# Altium schematic sheet [03] - MCU.SchDoc
size A3
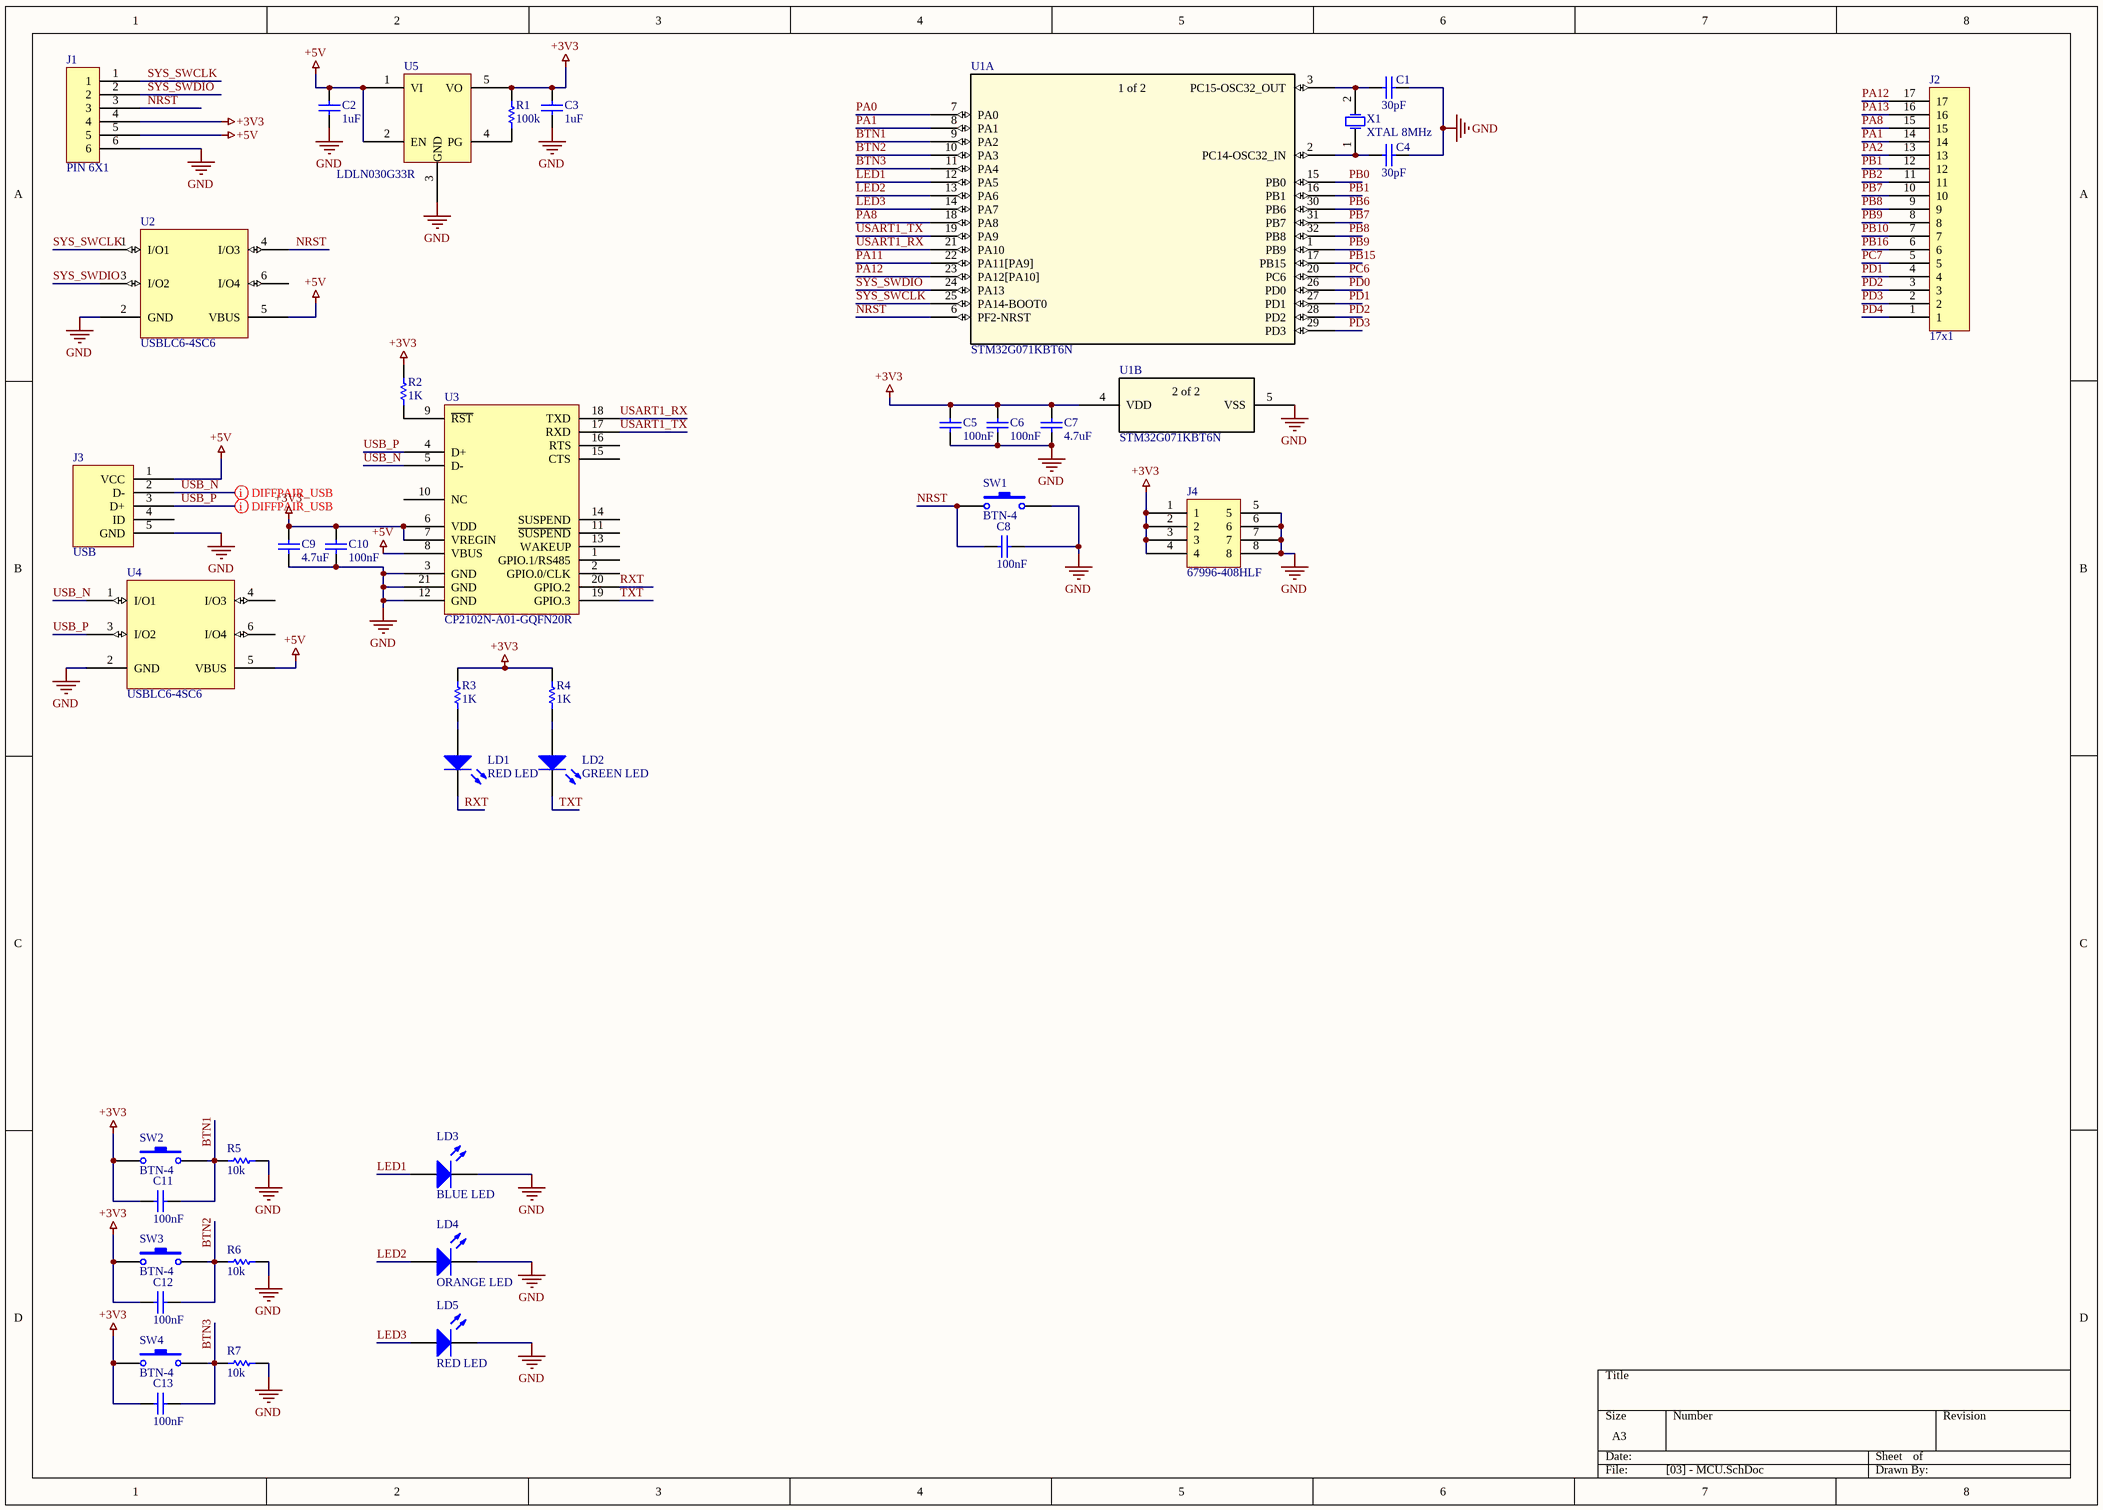
[diagram p0: [03] - MCU.SchDoc]

## Parts
C1  30pF  [CAPC2012X08N]
C2  1uF
C3  1uF
C4  30pF  [CAPC2012X08N]
C5  100nF  [CAPC2012X08N]
C6  100nF  [CAPC2012X08N]
C7  4.7uF
C8  100nF  [CAPC2012X08N]
C9  4.7uF
C10  100nF  [CAPC2012X08N]
C11  100nF  [CAPC2012X08N]
C12  100nF  [CAPC2012X08N]
C13  100nF  [CAPC2012X08N]
J1  PIN 6X1  [PIN6X1]
J2  17x1  [PIN17X1]
J3  USB  [AMPHENOL-usb]
J4  67996-408HLF  [PIN8X2]
LD1  RED LED  [LED SML]
LD2  GREEN LED  [LED SML]
LD3  BLUE LED  [LED APHD]
LD4  ORANGE LED  [LED SML]
LD5  RED LED  [LED SML]
R1  100k
R2  1K
R3  1K
R4  1K
R5  10k
R6  10k
R7  10k
SW1  BTN-4  [PTS645]
SW2  BTN-4  [PTS645]
SW3  BTN-4  [PTS645]
SW4  BTN-4  [PTS645]
U1  STM32G071KBT6N  [LQFP-32]  (parts A,B of 2)
U2  USBLC6-4SC6  [SOT95P280X145-6N]
U3  CP2102N-A01-GQFN20R  [*SILABS_QFN20]
U4  USBLC6-4SC6  [SOT95P280X145-6N]
U5  LDLN030G33R  [SOT95P280X100-5N]
X1  XTAL 8MHz  [HC-49S]

## Nets
+3V3: C3.2 C5.2 C6.2 C7.2 C9.2 C10.2 C11.2 C12.2 C13.2 J1.4 J4.1 J4.2 J4.3 J4.4 R1.2 R2.2 R3.1 R4.1 SW2.1 SW3.1 SW4.1 U1.4(VDD) U3.6(VDD) U3.7(VREGIN) U5.5(VO)
+5V: C2.2 J1.5 J3.1(VCC) U2.5(VBUS) U3.8(VBUS) U4.5(VBUS) U5.1(VI) U5.2(EN)
GND: C1.2 C2.1 C3.1 C4.2 C5.1 C6.1 C7.1 C8.1 C9.1 C10.1 J1.6 J3.5(GND) J4.5 J4.6 J4.7 J4.8 LD3.2(K) LD4.2(K) LD5.2(K) R5.2 R6.2 R7.2 SW1.2 U1.5(VSS) U2.2(GND) U3.3(GND) U3.12(GND) U3.21(GND) U4.2(GND) U5.3(GND)
BTN1: C11.1 R5.1 SW2.2 U1.9(PA2)
BTN2: C12.1 R6.1 SW3.2 U1.10(PA3)
BTN3: C13.1 R7.1 SW4.2 U1.11(PA4)
LED1: LD3.1(A) U1.12(PA5)
LED2: LD4.1(A) U1.13(PA6)
LED3: LD5.1(A) U1.14(PA7)
NRST: C8.2 J1.3 SW1.1 U1.6(PF2-NRST) U2.4(I/O3)
PA0: U1.7(PA0)
PA1: J2.14 U1.8(PA1)
PA2: J2.13
PA8: J2.15 U1.18(PA8)
PA11: U1.22(PA11[PA9])
PA12: J2.17 U1.23(PA12[PA10])
PA13: J2.16
PB0: U1.15(PB0)
PB1: J2.12 U1.16(PB1)
PB2: J2.11
PB6: U1.30(PB6)
PB7: J2.10 U1.31(PB7)
PB8: J2.9 U1.32(PB8)
PB9: J2.8 U1.1(PB9)
PB10: J2.7
PB15: U1.17(PB15)
PB16: J2.6
PC6: U1.20(PC6)
PC7: J2.5
PD0: U1.26(PD0)
PD1: J2.4 U1.27(PD1)
PD2: J2.3 U1.28(PD2)
PD3: J2.2 U1.29(PD3)
PD4: J2.1
RXT: LD1.2(K) U3.20(GPIO.2)
SYS_SWCLK: J1.1 U1.25(PA14-BOOT0) U2.1(I/O1)
SYS_SWDIO: J1.2 U1.24(PA13) U2.3(I/O2)
TXT: LD2.2(K) U3.19(GPIO.3)
USART1_RX: U1.21(PA10) U3.18(TXD)
USART1_TX: U1.19(PA9) U3.17(RXD)
USB_N: J3.2(D-) U3.5(D-) U4.1(I/O1)
USB_P: J3.3(D+) U3.4(D+) U4.3(I/O2)
NetC1_1: C1.1 U1.3(PC15-OSC32_OUT) X1.2(OSC2)
NetC4_1: C4.1 U1.2(PC14-OSC32_IN) X1.1(OSC1)
NetLD1_1: LD1.1(A) R3.2
NetLD2_1: LD2.1(A) R4.2
NetR1_1: R1.1 U5.4(PG)
NetR2_1: R2.1 U3.9(~{RST})

Not connected (* = marked no-connect by the designer): J3 4(ID); U2 6(I/O4); U3 1(GPIO.1/RS485) 2(GPIO.0/CLK) 10(NC) 11(~{SUSPEND}) 13(WAKEUP) 14(SUSPEND) 15(CTS) 16(RTS); U4 4(I/O3) 6(I/O4)

## Layout directives
differential pair: USB_N, USB_P

## Notes on the sheet
- (in symbol STM32G071KBT6N, part A) 1 of 2
- (in symbol STM32G071KBT6N, part B) 2 of 2

## Library data of the parts
C1 C4 = CL21C300JBANNNC: Cap Ceramic 30pF 50V C0G 5% SMD 0805 125C Paper T/R; Manufacturer: Samsung; Temperature Coefficient: 300ppm/°C; Supplier 1: Digi-Key; Manufacturer Part Number: CL21C300JBANNNC; Stock 1: 1482; Pricing 1: 1 = 0,10000, 10 = 0,06500, 100 = 0,02910, 500 = 0,02080, 1000 = 0,01634 (USD); RoHS: Yes; Mount: Surface Mount; Case/Package: 0805; Case Code (Metric): 2012; Case Code (Imperial): 0805; Min Operating Temperature: -55°C; Max Operating Temperature: 125°C; Package Quantity: 1; Packaging: Tape and Reel; Capacitance: 30pF; Tolerance: 5%; Voltage Rating: 50V; Dielectric: C0G; Voltage: 50V; Length: 2mm; Height: 0.65mm; Width: 0.049inch; Thickness: 0.03inch; Depth: 1.25mm; Radiation Hardening: No; ComponentLink1URL: https://datasheet.ciiva.com/26878/getdatasheetpartid-664450-26878150.pdf?src-supplier=Verical; ComponentLink1Description: https://datasheet.ciiva.com/26878/getdatasheetpartid-664450-26878150.pdf?src-supplier=Verical; ComponentLink2URL: https://datasheet.ciiva.com/16428/cl21c020bbannnc-16428903.pdf?src-supplier=Future+Electronics; ComponentLink2Description: https://datasheet.ciiva.com/16428/cl21c020bbannnc-16428903.pdf?src-supplier=Future+Electronics; Supplier Part Number 1: 1276-1130-1-ND
C2 C3 = CL21B105KAFNNNE: Cap Ceramic 1uF 25V X7R 10% SMD 0805 125C T/R; Manufacturer: Samsung; Supplier 1: Digi-Key; Manufacturer Part Number: CL21B105KAFNNNE; Stock 1: 1389367; Pricing 1: 1 = 0,11000, 10 = 0,07900, 100 = 0,03520, 500 = 0,02516, 1000 = 0,01977 (USD); RoHS: Yes; Mount: Surface Mount; Case/Package: 0805; Contact Plating: Tin; Case Code (Metric): 2012; Case Code (Imperial): 0805; Min Operating Temperature: -55°C; Max Operating Temperature: 125°C; Packaging: Tape and Reel; Package Quantity: 1; Capacitance: 1uF; Tolerance: 10%; Voltage Rating: 25V; Dielectric: X7R; Voltage: 25V; Voltage Rating (DC): 25V; Length: 2mm; Height: 1.25mm; Depth: 1.25mm; Width: 0.049inch; Thickness: 0.053inch; Radiation Hardening: No; Lead Free: Lead Free; ComponentLink1URL: https://datasheet.ciiva.com/25800/cl21b105kafnnne-25800163.pdf?src-supplier=Digi-Key; ComponentLink1Description: https://datasheet.ciiva.com/25800/cl21b105kafnnne-25800163.pdf?src-supplier=Digi-Key; ComponentLink2URL: https://datasheet.ciiva.com/15195/getdatasheetpartid-355205-15195880.pdf?src-supplier=Verical; ComponentLink2Description: https://datasheet.ciiva.com/15195/getdatasheetpartid-355205-15195880.pdf?src-supplier=Verical; Supplier Part Number 1: 1276-1066-1-ND
C5 C6 C8 C10-C13 = CL21F104ZBCNNNC: Cap Ceramic 0.1uF 50V Y5V -20% to 80% SMD 0805 85C Paper T/R; Manufacturer: Samsung; Supplier 1: Digi-Key; Manufacturer Part Number: CL21F104ZBCNNNC; Stock 1: 3380807; Pricing 1: 1 = 0,10000, 10 = 0,04400, 100 = 0,01950, 500 = 0,01390, 1000 = 0,01092 (USD); RoHS: Yes; Mount: Surface Mount; Case/Package: 0805; Case Code (Metric): 2012; Case Code (Imperial): 0805; Material: Ceramic; Min Operating Temperature: -30°C; Max Operating Temperature: 85°C; Capacitance: 100nF; Tolerance: 80%; Dielectric: Y5V; Packaging: Tape and Reel; Voltage Rating: 50V; Package Quantity: 1; Length: 2mm; Height: 0.85mm; Width: 0.049inch; Thickness: 0.037inch; Depth: 1.25mm; Radiation Hardening: No; ComponentLink1URL: https://datasheet.ciiva.com/26878/getdatasheetpartid-466953-26878177.pdf?src-supplier=Verical; ComponentLink1Description: https://datasheet.ciiva.com/26878/getdatasheetpartid-466953-26878177.pdf?src-supplier=Verical; ComponentLink2URL: https://datasheet.ciiva.com/29199/454191-da-01-en-vs-kondensator-0805-29199731.pdf?src-supplier=Conrad; ComponentLink2Description: https://datasheet.ciiva.com/29199/454191-da-01-en-vs-kondensator-0805-29199731.pdf?src-supplier=Conrad; Supplier Part Number 1: 1276-1007-1-ND
C7 C9 = CL21A475KOFNNNE: Cap Ceramic 4.7uF 16V X5R 10% SMD 0805 85C Embossed T/R; Manufacturer: Samsung; Manufacturer Part Number: CL21A475KOFNNNE; Stock 1: 1688520; Pricing 1: 1 = 0,17000, 10 = 0,11600, 100 = 0,05860, 500 = 0,04010, 1000 = 0,03547 (USD); RoHS: Yes; Mount: Surface Mount; Case/Package: 0805; Case Code (Metric): 2012; Case Code (Imperial): 0805; Contact Plating: Tin; Min Operating Temperature: -55°C; Max Operating Temperature: 85°C; Tolerance: 10%; Capacitance: 4.7uF; Dielectric: X5R; Packaging: Tape and Reel; Voltage Rating: 16V; Length: 2mm; Height: 1.25mm; Width: 0.049inch; Thickness: 0.053inch; Depth: 1.25mm; Radiation Hardening: No; ComponentLink1URL: https://datasheet.ciiva.com/26838/getdatasheetpartid-357424-26838625.pdf?src-supplier=Verical; ComponentLink1Description: https://datasheet.ciiva.com/26838/getdatasheetpartid-357424-26838625.pdf?src-supplier=Verical; ComponentLink2URL: https://datasheet.ciiva.com/25710/cl21a475kofnnne-25710354.pdf?src-supplier=Digi-Key; ComponentLink2Description: https://datasheet.ciiva.com/25710/cl21a475kofnnne-25710354.pdf?src-supplier=Digi-Key; ComponentLink3URL: https://datasheet.ciiva.com/16740/cl21a475kofnnne-16740646.pdf?src-supplier=Future+Electronics; ComponentLink3Description: https://datasheet.ciiva.com/16740/cl21a475kofnnne-16740646.pdf?src-supplier=Future+Electronics; Supplier Part Number 1: 1276-1065-1-ND; Supplier 1: Digi-Key
J1 = 640456-6: CONN HEADER VERT 6POS 2.54MM; Manufacturer: AMP - TE CONNECTIVITY; Supplier 1: Digi-Key; Manufacturer Part Number: 640456-6; Stock 1: 78936; Pricing 1: 1 = 0,26000, 10 = 0,24500, 100 = 0,17180, 500 = 0,14726, 1000 = 0,12271, 5000 = 0,10518, 10000 = 0,09817 (USD); RoHS: No; ComponentLink1URL: http://www.farnell.com/datasheets/2043229.pdf?src-supplier=Farnell; ComponentLink1Description: http://www.farnell.com/datasheets/2043229.pdf?src-supplier=Farnell; ComponentLink2URL: http://www.farnell.com/datasheets/2043229.pdf?src-supplier=Newark; ComponentLink2Description: http://www.farnell.com/datasheets/2043229.pdf?src-supplier=Newark; ComponentLink3URL: https://www.te.com/commerce/DocumentDelivery/DDEController?Action=srchrtrv&DocNm=640456&DocType=Customer+Drawing&DocLang=English&src-supplier=Digi-Key; ComponentLink3Description: https://www.te.com/commerce/DocumentDelivery/DDEController?Action=srchrtrv&DocNm=640456&DocType=Customer+Drawing&DocLang=English&src-supplier=Digi-Key; Supplier Part Number 1: A1923-ND
J2 = 1-640456-7: CONN HEADER VERT 17POS .100 TIN; Manufacturer: TE Connectivity; Underplate Material: Nickel; Number of Positions: 17; Connector Type: Plug; Current Rating: 5A; Mating Alignment: No (Without); Voltage Rating (AC): 250V; Contact Resistance: 6mR; Connector System: Wire-to-Board; PCB Mount Retention: Without; Plating Thickness: 3.81um; Gender: Male; PCB Mounting Orientation: Vertical; Pitch: 2.54mm; PCB Thickness: 0.063inch; Tail Length: 3.56mm; Approvals: CSA; Supplier 1: Digi-Key; Manufacturer Part Number: 1-640456-7; Stock 1: 2272; Pricing 1: 1 = 1,44000, 10 = 1,26400, 100 = 1,09020, 500 = 0,89198, 1000 = 0,79286, 5000 = 0,69376, 10000 = 0,65907 (USD); RoHS: Yes; Mount: Through Hole; Color: Natural; Housing Material: Polyester; Contact Plating: Tin; Contact Material: Copper Alloy; Housing Color: Natural; Contact Shape: Square; Min Operating Temperature: -67°C; Max Operating Temperature: 221°C; Number of Rows: 1; Termination: Solder; Packaging: Bulk; Contact Gender: Male; Package Quantity: 1; Fastening Type: Friction; Number of Contacts: 17; Shrouded: No (Without); Orientation: Straight; Contact Retention: No (Without); Mating Retention: No (Without); PCB Mount Alignment: No (Without); Strain Relief: No (Without); Contact Current Rating: 5A; Backwall/Post Interruptions: No (Without); Sealable: No (Without); Max Voltage Rating (AC): 250V; Voltage Rating: 250V; Voltage Rating (DC): 250V; Length: 1.7inch; Height: 7.87mm; Depth: 5.71mm; Contact Mating Length: 0.295inch; Radiation Hardening: No; ELV: Compliant; Lead Free: Lead Free; Flammability Rating: UL94 V-0; REACH SVHC: Unknown; ComponentLink1URL: https://datasheet.ciiva.com/11746/0900766b80daadc9-11746773.pdf?src-supplier=RSComponents; ComponentLink1Description: https://datasheet.ciiva.com/11746/0900766b80daadc9-11746773.pdf?src-supplier=RSComponents; ComponentLink2URL: https://datasheet.ciiva.com/16686/eng-ds-82056-mta-0608-16686728.pdf?src-supplier=Avnet+Europe; ComponentLink2Description: https://datasheet.ciiva.com/16686/eng-ds-82056-mta-0608-16686728.pdf?src-supplier=Avnet+Europe; ComponentLink3URL: https://datasheet.ciiva.com/18486/eng-cd-640456-w2-18486652.pdf?src-supplier=Digi-Key; ComponentLink3Description: https://datasheet.ciiva.com/18486/eng-cd-640456-w2-18486652.pdf?src-supplier=Digi-Key; ComponentLink4URL: https://datasheet.ciiva.com/710/eng-cd-640456-w2-710061.pdf?src-supplier=Digi-Key; ComponentLink4Description: https://datasheet.ciiva.com/710/eng-cd-640456-w2-710061.pdf?src-supplier=Digi-Key; Supplier Part Number 1: A112543-ND
J3 = 10118194-0001LF: CONN RCPT USB2.0 MICRO B SMD R/A; Manufacturer: Amphenol FCI; Gender: Receptacle; Current Rating: 1.8A; Number of Contacts: 5; Insulation Resistance: 1GR; Number of Ports: 1; Max Voltage Rating (AC): 100V; Pitch: 0.65mm; Supplier 1: Digi-Key; Manufacturer Part Number: 10118194-0001LF; Stock 1: 84775; Pricing 1: 1 = 0,42000, 10 = 0,39300, 25 = 0,35360, 50 = 0,31440, 100 = 0,30130, 250 = 0,27512, 500 = 0,26202 (USD); RoHS: Yes; Mount: Surface Mount; Color: Black; Contact Material: Copper Alloy; Contact Plating: Gold; Number of Terminals: 5; Housing Material: Polymer; Min Operating Temperature: -55°C; Max Operating Temperature: 85°C; Package Quantity: 9600; Packaging: Tape and Reel; Connector Type: USB; Termination: Solder; Orientation: Right Angle; Features: Shielded; Length: 8.05mm; Depth: 5mm; Radiation Hardening: No; Lead Free: Lead Free; Flammability Rating: UL94 V-0; ComponentLink1URL: https://datasheet.ciiva.com/4598/10118194ac-197217-4598807.pdf?src-supplier=Mouser; ComponentLink1Description: https://datasheet.ciiva.com/4598/10118194ac-197217-4598807.pdf?src-supplier=Mouser; ComponentLink2URL: https://datasheet.ciiva.com/26945/getdatasheetpartid-418619-26945695.pdf?src-supplier=Verical; ComponentLink2Description: https://datasheet.ciiva.com/26945/getdatasheetpartid-418619-26945695.pdf?src-supplier=Verical; ComponentLink3URL: https://datasheet.ciiva.com/851/10118194-851110.pdf?src-supplier=Digi-Key; ComponentLink3Description: https://datasheet.ciiva.com/851/10118194-851110.pdf?src-supplier=Digi-Key; ComponentLink4URL: https://datasheet.ciiva.com/851/10118194-851111.pdf?src-supplier=Digi-Key; ComponentLink4Description: https://datasheet.ciiva.com/851/10118194-851111.pdf?src-supplier=Digi-Key; Supplier Part Number 1: 609-4618-1-ND
J4 = 67996-408HLF: CONN HEADER VERT 8POS 2.54MM; Manufacturer: Amphenol FCI; Current Rating: 3A; Voltage Rating: 1.5kV; Number of Positions: 8; Insulation Resistance: 5GR; Gender: Male; Connector Type: Male Pin; Row Spacing: 0.1inch; Contact Post Length: 2.41mm; Supplier 1: Digi-Key; Manufacturer Part Number: 67996-408HLF; Stock 1: 4279; Pricing 1: 1 = 0,34000, 10 = 0,32300, 100 = 0,22640, 500 = 0,19404, 1000 = 0,16170, 5000 = 0,13860, 10000 = 0,12936 (USD); RoHS: Yes; Mount: Through Hole; Color: Black; Housing Color: Black; Housing Material: Thermoplastic; Contact Plating: Tin; Contact Material: Bronze; Min Operating Temperature: -65°C; Max Operating Temperature: 125°C; Number of Rows: 2; Packaging: Bulk; Contact Gender: Male; Package Quantity: 100; Termination: Solder; Max Voltage Rating (AC): 1.5kV; Number of Contacts: 8; Orientation: Straight; Length: 10.16mm; Pitch: 2.54mm; Depth: 4.83mm; Contact Mating Length: 0.23inch; Radiation Hardening: No; Lead Free: Lead Free; ComponentLink1URL: https://datasheet.ciiva.com/720/67996-720731.pdf?src-supplier=Digi-Key; ComponentLink1Description: https://datasheet.ciiva.com/720/67996-720731.pdf?src-supplier=Digi-Key; ComponentLink2URL: https://datasheet.ciiva.com/16726/67996-16726282.pdf?src-supplier=Avnet+Europe; ComponentLink2Description: https://datasheet.ciiva.com/16726/67996-16726282.pdf?src-supplier=Avnet+Europe; Supplier Part Number 1: 609-3391-ND
LD1 LD5 = SML-D12U1WT86: LED RED DIFFUSED 1608 SMD; Manufacturer: Rohm; Lens Color: White; Luminous Intensity: 63mcd; Test Current: 20mA; Dominant Wavelength: 620nm; Forward Voltage: 2.2V; Supplier 1: Digi-Key; Manufacturer Part Number: SML-D12U1WT86; Stock 1: 91784; Pricing 1: 1 = 0,22000, 10 = 0,16200, 25 = 0,11920, 100 = 0,08530, 250 = 0,05796, 500 = 0,05116, 1000 = 0,04007 (USD); RoHS: Yes; Mount: Surface Mount; Case/Package: 0603; Color: Red; Case Code (Metric): 1608; Case Code (Imperial): 0603; Packaging: Tape and Reel; Lens Transparency: Diffused; Length: 1.6mm; Height: 0.65mm; Width: 0.8mm; Lead Free: Lead Free; ComponentLink1URL: https://www.rohm.com/datasheet/SML-D12U1W?src-supplier=Digi-Key; ComponentLink1Description: https://www.rohm.com/datasheet/SML-D12U1W?src-supplier=Digi-Key; Supplier Part Number 1: SML-D12U1WT86CT-ND
LD2 = SML-D12M1WT86: LED YLW/GREEN DIFFUSED 1608 SMD; Manufacturer: Rohm; Lens Color: White; Luminous Intensity: 40mcd; Test Current: 20mA; Dominant Wavelength: 572nm; Forward Voltage: 2.2V; Supplier 1: Digi-Key; Manufacturer Part Number: SML-D12M1WT86; Stock 1: 8; Pricing 1: 1 = 0,22000, 10 = 0,16200, 25 = 0,11920, 100 = 0,08530, 250 = 0,05796, 500 = 0,05116, 1000 = 0,04007 (USD); RoHS: Yes; Mount: Surface Mount; Case/Package: 0603; Color: Green; Case Code (Metric): 1608; Case Code (Imperial): 0603; Packaging: Tape and Reel; Lens Transparency: Diffused; Length: 1.6mm; Height: 0.65mm; Width: 0.8mm; Lead Free: Lead Free; ComponentLink1URL: https://www.rohm.com/datasheet/SML-D12M1W?src-supplier=Digi-Key; ComponentLink1Description: https://www.rohm.com/datasheet/SML-D12M1W?src-supplier=Digi-Key; Supplier Part Number 1: SML-D12M1WT86CT-ND
LD3 = APHD1608LQBC/D: LED BLUE CLEAR 1608 SMD; Manufacturer: Kingbright; Supplier 1: Digi-Key; Manufacturer Part Number: APHD1608LQBC/D; Stock 1: 19890; Pricing 1: 1 = 0,56000, 10 = 0,40400, 25 = 0,33000, 100 = 0,26400, 250 = 0,22276, 500 = 0,18976, 1000 = 0,14850 (USD); RoHS: No; ComponentLink1URL: http://www.kingbrightusa.com/images/catalog/SPEC/APHD1608LQBC-D.pdf?src-supplier=Digi-Key; ComponentLink1Description: http://www.kingbrightusa.com/images/catalog/SPEC/APHD1608LQBC-D.pdf?src-supplier=Digi-Key; Supplier Part Number 1: 754-2034-1-ND
LD4 = SML-D12D1WT86: LED ORANGE DIFFUSED 1608 SMD; Manufacturer: Rohm; Lens Color: White; Luminous Intensity: 100mcd; Test Current: 20mA; Dominant Wavelength: 605nm; Forward Voltage: 2.2V; Supplier 1: Digi-Key; Manufacturer Part Number: SML-D12D1WT86; Stock 1: 39249; Pricing 1: 1 = 0,22000, 10 = 0,16200, 25 = 0,11920, 100 = 0,08530, 250 = 0,05796, 500 = 0,05116, 1000 = 0,04007 (USD); RoHS: Yes; Mount: Surface Mount; Case/Package: 0603; Color: Orange; Case Code (Metric): 1608; Case Code (Imperial): 0603; Packaging: Tape and Reel; Lens Transparency: Diffused; Length: 1.6mm; Height: 0.65mm; Width: 0.8mm; Lead Free: Lead Free; ComponentLink1URL: https://www.rohm.com/datasheet/SML-D12D1W?src-supplier=Digi-Key; ComponentLink1Description: https://www.rohm.com/datasheet/SML-D12D1W?src-supplier=Digi-Key; Supplier Part Number 1: SML-D12D1WT86CT-ND
R1 = RMCF0805FT100K: RES 100K OHM 1% 1/8W 0805; Manufacturer: Stackpole Electronics; Resistance: 100kR; Power Rating: 125mW; Temperature Coefficient: 100ppm/°C; Working Voltage: 150V; Supplier 1: Digi-Key; Manufacturer Part Number: RMCF0805FT100K; Stock 1: 620646; Pricing 1: 1 = 0,10000, 10 = 0,02700, 100 = 0,01090, 1000 = 0,00490, 2500 = 0,00425 (USD); RoHS: Yes; Mount: Surface Mount; Case/Package: 0805; Case Code (Metric): 2012; Case Code (Imperial): 0805; Contact Plating: Tin; Min Operating Temperature: -55°C; Max Operating Temperature: 155°C; Tolerance: 1%; Packaging: Tape and Reel; Composition: Thick Film; Number of Terminations: 2; Military Standard: Not; Max Power Dissipation: 125mW; Features: Automotive AEC-Q200; Length: 2mm; Height: 0.026inch; Width: 0.049inch; Depth: 1.25mm; Radiation Hardening: No; Lead Free: Lead Free; ComponentLink1URL: http://components.arrow.com/part/dataview/50568053S7005095N1174?src-supplier=Arrow; ComponentLink1Description: http://components.arrow.com/part/dataview/50568053S7005095N1174?src-supplier=Arrow; ComponentLink2URL: https://www.verical.com/server-webapp/html/getDatasheet?partID=360692&src-supplier=Verical; ComponentLink2Description: https://www.verical.com/server-webapp/html/getDatasheet?partID=360692&src-supplier=Verical; ComponentLink3URL: http://www.onlinecomponents.com/productFiles/mf-SEI/sei-rmcp.pdf?src-supplier=Onlinecomponents.com; ComponentLink3Description: http://www.onlinecomponents.com/productFiles/mf-SEI/sei-rmcp.pdf?src-supplier=Onlinecomponents.com; ComponentLink4URL: http://www.seielect.com/catalog/sei-rmc.pdf?src-supplier=Future+Electronics; ComponentLink4Description: http://www.seielect.com/catalog/sei-rmc.pdf?src-supplier=Future+Electronics; ComponentLink5URL: https://www.seielect.com/catalog/SEI-Packaging.pdf?src-supplier=Digi-Key; ComponentLink5Description: https://www.seielect.com/catalog/SEI-Packaging.pdf?src-supplier=Digi-Key; ComponentLink6URL: https://www.seielect.com/catalog/SEI-RMCF_RMCP.pdf?src-supplier=Avnet; ComponentLink6Description: https://www.seielect.com/catalog/SEI-RMCF_RMCP.pdf?src-supplier=Avnet; Supplier Part Number 1: RMCF0805FT100KCT-ND
R2-R4 = RNCP0805FTD1K00: RES 1K OHM 1% 1/4W 0805; Manufacturer: Stackpole Electronics; Resistance: 1kR; Power Rating: 250mW; Temperature Coefficient: 100ppm/°C; Supplier 1: Digi-Key; Manufacturer Part Number: RNCP0805FTD1K00; Stock 1: 707698; Pricing 1: 1 = 0,10000, 10 = 0,07200, 100 = 0,02770, 1000 = 0,01220, 2500 = 0,01053 (USD); RoHS: Yes; Mount: Surface Mount; Case/Package: 0805; Case Code (Metric): 2012; Case Code (Imperial): 0805; Min Operating Temperature: -55°C; Max Operating Temperature: 155°C; Tolerance: 1%; Packaging: Tape and Reel; Composition: Thin Film; Number of Terminations: 2; Max Power Dissipation: 250mW; Features: Moisture Resistant; Length: 0.079inch; Height: 0.024inch; Width: 0.049inch; Lead Free: Lead Free; ComponentLink1URL: http://www.seielect.com/Catalog/SEI-rncp.pdf?src-supplier=Future+Electronics; ComponentLink1Description: http://www.seielect.com/Catalog/SEI-rncp.pdf?src-supplier=Future+Electronics; ComponentLink2URL: https://www.seielect.com/catalog/SEI-Packaging.pdf?src-supplier=Digi-Key; ComponentLink2Description: https://www.seielect.com/catalog/SEI-Packaging.pdf?src-supplier=Digi-Key; ComponentLink3URL: https://www.seielect.com/Catalog/SEI-rncp.pdf?src-supplier=Digi-Key; ComponentLink3Description: https://www.seielect.com/Catalog/SEI-rncp.pdf?src-supplier=Digi-Key; Supplier Part Number 1: RNCP0805FTD1K00CT-ND
R5-R7 = RMCF0805FT10K0: RES 10K OHM 1% 1/8W 0805; Manufacturer: Stackpole Electronics; Resistance: 10kR; Power Rating: 125mW; Temperature Coefficient: 100ppm/°C; Supplier 1: Digi-Key; Manufacturer Part Number: RMCF0805FT10K0; Stock 1: 5756590; Pricing 1: 1 = 0,10000, 10 = 0,02700, 100 = 0,01090, 1000 = 0,00490, 2500 = 0,00425 (USD); RoHS: Yes; Mount: Surface Mount; Case/Package: 0805; Case Code (Metric): 2012; Case Code (Imperial): 0805; Contact Plating: Tin; Min Operating Temperature: -55°C; Max Operating Temperature: 155°C; Tolerance: 1%; Packaging: Tape and Reel; Composition: Thick Film; Number of Terminations: 2; Military Standard: Not; Max Power Dissipation: 125mW; Features: Automotive AEC-Q200; Length: 2mm; Height: 0.026inch; Width: 0.049inch; Depth: 1.25mm; Radiation Hardening: No; Lead Free: Lead Free; ComponentLink1URL: https://datasheet.ciiva.com/15193/getdatasheetpartid-362046-15193525.pdf?src-supplier=Verical; ComponentLink1Description: https://datasheet.ciiva.com/15193/getdatasheetpartid-362046-15193525.pdf?src-supplier=Verical; Supplier Part Number 1: RMCF0805FT10K0CT-ND
SW1-SW4 = PTS645SM43SMTR92LFS: SWITCH TACTILE SPST-NO 0.05A 12V; Manufacturer: ITT C&K; Mechanical Life: 100000Cycles; Actuator Material: Nylon; Throw Configuration: SPST; Contact Resistance: 100mR; Operating Force: 160gf; Max Current Rating: 50mA; Illumination Type: Non-Illuminated; Switch Function: Off-Mom; Actuator Type: Standard; Actuator Length: 0.85mm; Supplier 1: Digi-Key; Manufacturer Part Number: PTS645SM43SMTR92LFS; Stock 1: 397326; Pricing 1: 1 = 0,16000, 10 = 0,15700, 25 = 0,15160, 50 = 0,14620, 100 = 0,13810, 250 = 0,12996, 500 = 0,12452 (USD); RoHS: Yes; Mount: Surface Mount; Case/Package: SMD/SMT; Contact Plating: Silver; Contact Material: Silver; Color: Black; Min Operating Temperature: -20°C; Max Operating Temperature: 60°C; Max Voltage Rating (DC): 12V; Packaging: Tape and Reel; Package Quantity: 1000; Current Rating: 50mA; Voltage Rating (DC): 12V; Termination: Gull Wing; Orientation: Straight; Length: 6mm; Depth: 9mm; REACH SVHC: No SVHC; Lead Free: Lead Free; ComponentLink1URL: https://datasheet.ciiva.com/29903/getdatasheetpartid-786341-29903846.pdf?src-supplier=Verical; ComponentLink1Description: https://datasheet.ciiva.com/29903/getdatasheetpartid-786341-29903846.pdf?src-supplier=Verical; ComponentLink2URL: https://datasheet.ciiva.com/29931/getdatasheetpartid-764615-29931183.pdf?src-supplier=Verical; ComponentLink2Description: https://datasheet.ciiva.com/29931/getdatasheetpartid-764615-29931183.pdf?src-supplier=Verical; ComponentLink3URL: https://datasheet.ciiva.com/14920/pts645-14920733.pdf?src-supplier=Digi-Key; ComponentLink3Description: https://datasheet.ciiva.com/14920/pts645-14920733.pdf?src-supplier=Digi-Key; ComponentLink4URL: https://datasheet.ciiva.com/14920/pts645-14920734.pdf?src-supplier=Digi-Key; ComponentLink4Description: https://datasheet.ciiva.com/14920/pts645-14920734.pdf?src-supplier=Digi-Key; ComponentLink5URL: https://datasheet.ciiva.com/14920/pts645-14920735.pdf?src-supplier=Digi-Key; ComponentLink5Description: https://datasheet.ciiva.com/14920/pts645-14920735.pdf?src-supplier=Digi-Key; Supplier Part Number 1: CKN9112CT-ND
U1 = STM32G071KBT6N: Manufacturer_Part_Number: STM32G0_LQFP32PD_T1; Built_By: EMA_Jessica; Vendor: STMicroelectronics; Copyright: Copyright (C) 2016 Accelerated Designs. All rights reserved; RefDes: RefDes; Type: DEV; Value: Value; Supplier 1: Digi-Key; Manufacturer: STMicroelectronics; Manufacturer Part Number: STM32G071KBT6N; Stock 1: 1469; Pricing 1: 1 = 2,94000, 10 = 2,64500, 100 = 2,12640, 500 = 1,74702, 1000 = 1,44754 (USD); RoHS: No; Supplier Part Number 1: 497-18356-ND
U2 U4 = USBLC6-4SC6: TVS DIODE 5.25V 17V SOT23-6; Manufacturer: STMicroelectronics; Number of Elements: 1; Capacitance: 4pF; Direction: Unidirectional; Reverse Breakdown Voltage: 6V; Operating Supply Voltage: 860mV; Number of Channels: 4; Reverse Standoff Voltage: 5V; Power Line Protection: Yes; Leakage Current: 150nA; Peak Pulse Current: 5A; Test Current: 1mA; Max Breakdown Voltage: 10V; Max Reverse Leakage Current: 2uA; Supplier 1: Digi-Key; Manufacturer Part Number: USBLC6-4SC6; Stock 1: 59773; Pricing 1: 1 = 0,50000, 10 = 0,42500, 100 = 0,31720, 500 = 0,24926, 1000 = 0,19261 (USD); RoHS: Yes; Mount: Surface Mount; Case/Package: SOT-23; Number of Pins: 6; Weight: 0.01lb; Contact Plating: Tin; Min Operating Temperature: -40°C; Max Operating Temperature: 125°C; Package Quantity: 3000; Packaging: Tape and Reel; Number of Bidirectional Channels: 4; Min Breakdown Voltage: 6V; Clamping Voltage: 17V; Polarity: Unidirectional; Breakdown Voltage: 6V; Termination: SMD/SMT; Working Voltage: 5V; ESD Protection: Yes; Voltage Rating (DC): 5V; Length: 3mm; Height: 1.3mm; Width: 1.75mm; Depth: 1.75mm; Radiation Hardening: No; REACH SVHC: No SVHC; Lead Free: Lead Free; ComponentLink1URL: https://datasheet.ciiva.com/27052/1493951-27052291.pdf?src-supplier=Jameco; ComponentLink1Description: https://datasheet.ciiva.com/27052/1493951-27052291.pdf?src-supplier=Jameco; ComponentLink2URL: https://datasheet.ciiva.com/15143/getdatasheetpartid-88767-15143364.pdf?src-supplier=Verical; ComponentLink2Description: https://datasheet.ciiva.com/15143/getdatasheetpartid-88767-15143364.pdf?src-supplier=Verical; ComponentLink3URL: https://datasheet.ciiva.com/1220/48344-1220005.pdf?src-supplier=Newark; ComponentLink3Description: https://datasheet.ciiva.com/1220/48344-1220005.pdf?src-supplier=Newark; ComponentLink4URL: https://datasheet.ciiva.com/16206/cd00047494-16206119.pdf?src-supplier=Future+Electronics; ComponentLink4Description: https://datasheet.ciiva.com/16206/cd00047494-16206119.pdf?src-supplier=Future+Electronics; ComponentLink5URL: https://datasheet.ciiva.com/14186/usblc6-4-st-eng-tds-14186570.pdf?src-supplier=Distrelec; ComponentLink5Description: https://datasheet.ciiva.com/14186/usblc6-4-st-eng-tds-14186570.pdf?src-supplier=Distrelec; ComponentLink6URL: https://datasheet.ciiva.com/4507/cd00047494-112581-4507757.pdf?src-supplier=Mouser; ComponentLink6Description: https://datasheet.ciiva.com/4507/cd00047494-112581-4507757.pdf?src-supplier=Mouser; ComponentLink7URL: https://datasheet.ciiva.com/22692/1498406-22692454.pdf?src-supplier=Element14; ComponentLink7Description: https://datasheet.ciiva.com/22692/1498406-22692454.pdf?src-supplier=Element14; ComponentLink8URL: https://datasheet.ciiva.com/22685/1498406-22685833.pdf?src-supplier=Element14; ComponentLink8Description: https://datasheet.ciiva.com/22685/1498406-22685833.pdf?src-supplier=Element14; Supplier Part Number 1: 497-4492-1-ND
U3 = CP2102N-A01-GQFN20R: IC BRIDGE USB TO UART 20QFN; Manufacturer: Silicon Labs; Supplier 1: Digi-Key; Manufacturer Part Number: CP2102N-A01-GQFN20R; Stock 1: 14642; Pricing 1: 1 = 1,33000, 25 = 1,28080, 100 = 1,23170 (USD); RoHS: No; ComponentLink1URL: https://www.silabs.com/documents/public/data-sheets/cp2102n-datasheet.pdf?src-supplier=Digi-Key; ComponentLink1Description: https://www.silabs.com/documents/public/data-sheets/cp2102n-datasheet.pdf?src-supplier=Digi-Key; Supplier Part Number 1: 336-4826-1-ND
U5 = LDLN030G33R: IC REG LIN 3.3V 300MA TSOT23-5; Manufacturer: STMicroelectronics; Supplier 1: Digi-Key; Manufacturer Part Number: LDLN030G33R; Stock 1: 1583; Pricing 1: 1 = 0,45000, 10 = 0,36800, 100 = 0,25050, 500 = 0,18788, 1000 = 0,14090 (USD); RoHS: No; ComponentLink1URL: http://www.st.com/content/ccc/resource/technical/document/datasheet/group3/17/6b/17/5d/59/ae/4b/55/DM00473388/files/DM00473388.pdf/jcr:content/translations/en.DM00473388.pdf?src-supplier=Digi-Key; ComponentLink1Description: http://www.st.com/content/ccc/resource/technical/document/datasheet/group3/17/6b/17/5d/59/ae/4b/55/DM00473388/files/DM00473388.pdf/jcr:content/translations/en.DM00473388.pdf?src-supplier=Digi-Key; Supplier Part Number 1: 497-18013-1-ND
X1 = 9C-8.000MEEJ-T: CRYSTAL 8.0000MHZ 18PF SMD; Manufacturer: TXC; Frequency Tolerance: 10ppm; ESR (Equivalent Series Resistance): 80R; Supplier 1: Digi-Key; Manufacturer Part Number: 9C-8.000MEEJ-T; Stock 1: 62919; Pricing 1: 1 = 0,59000, 10 = 0,49500, 50 = 0,44560, 100 = 0,39600, 500 = 0,37620 (USD); RoHS: Yes; Mount: Surface Mount; Number of Pins: 2; Min Operating Temperature: -20°C; Max Operating Temperature: 70°C; Package Quantity: 1; Frequency: 8MHz; Load Capacitance: 18pF; Packaging: Tape and Reel; Tolerance: 10ppm; Frequency Stability: 10ppm; Termination: SMD/SMT; Length: 11.4mm; Height: 0.161inch; Width: 0.189inch; Depth: 4.8mm; REACH SVHC: No SVHC; ComponentLink1URL: https://datasheet.ciiva.com/854/9c-accuracy-854480.pdf?src-supplier=Digi-Key; ComponentLink1Description: https://datasheet.ciiva.com/854/9c-accuracy-854480.pdf?src-supplier=Digi-Key; ComponentLink2URL: https://datasheet.ciiva.com/22698/1497895-22698807.pdf?src-supplier=Element14; ComponentLink2Description: https://datasheet.ciiva.com/22698/1497895-22698807.pdf?src-supplier=Element14; ComponentLink3URL: https://datasheet.ciiva.com/28498/1497895-28498909.pdf?src-supplier=Element14; ComponentLink3Description: https://datasheet.ciiva.com/28498/1497895-28498909.pdf?src-supplier=Element14; ComponentLink4URL: https://datasheet.ciiva.com/854/9c-accuracy-854479.pdf?src-supplier=Digi-Key; ComponentLink4Description: https://datasheet.ciiva.com/854/9c-accuracy-854479.pdf?src-supplier=Digi-Key; ComponentLink5URL: https://datasheet.ciiva.com/4945/9c-13007-4945864.pdf?src-supplier=Mouser; ComponentLink5Description: https://datasheet.ciiva.com/4945/9c-13007-4945864.pdf?src-supplier=Mouser; ComponentLink6URL: https://datasheet.ciiva.com/1357/1794112-1357151.pdf?src-supplier=Element14; ComponentLink6Description: https://datasheet.ciiva.com/1357/1794112-1357151.pdf?src-supplier=Element14; ComponentLink7URL: https://datasheet.ciiva.com/854/9c-accuracy-854481.pdf?src-supplier=Digi-Key; ComponentLink7Description: https://datasheet.ciiva.com/854/9c-accuracy-854481.pdf?src-supplier=Digi-Key; Supplier Part Number 1: 887-1263-1-ND